# EAGLE schematic DAU_Kupplung_3phasig_V1_11 (EAGLE 6.1)
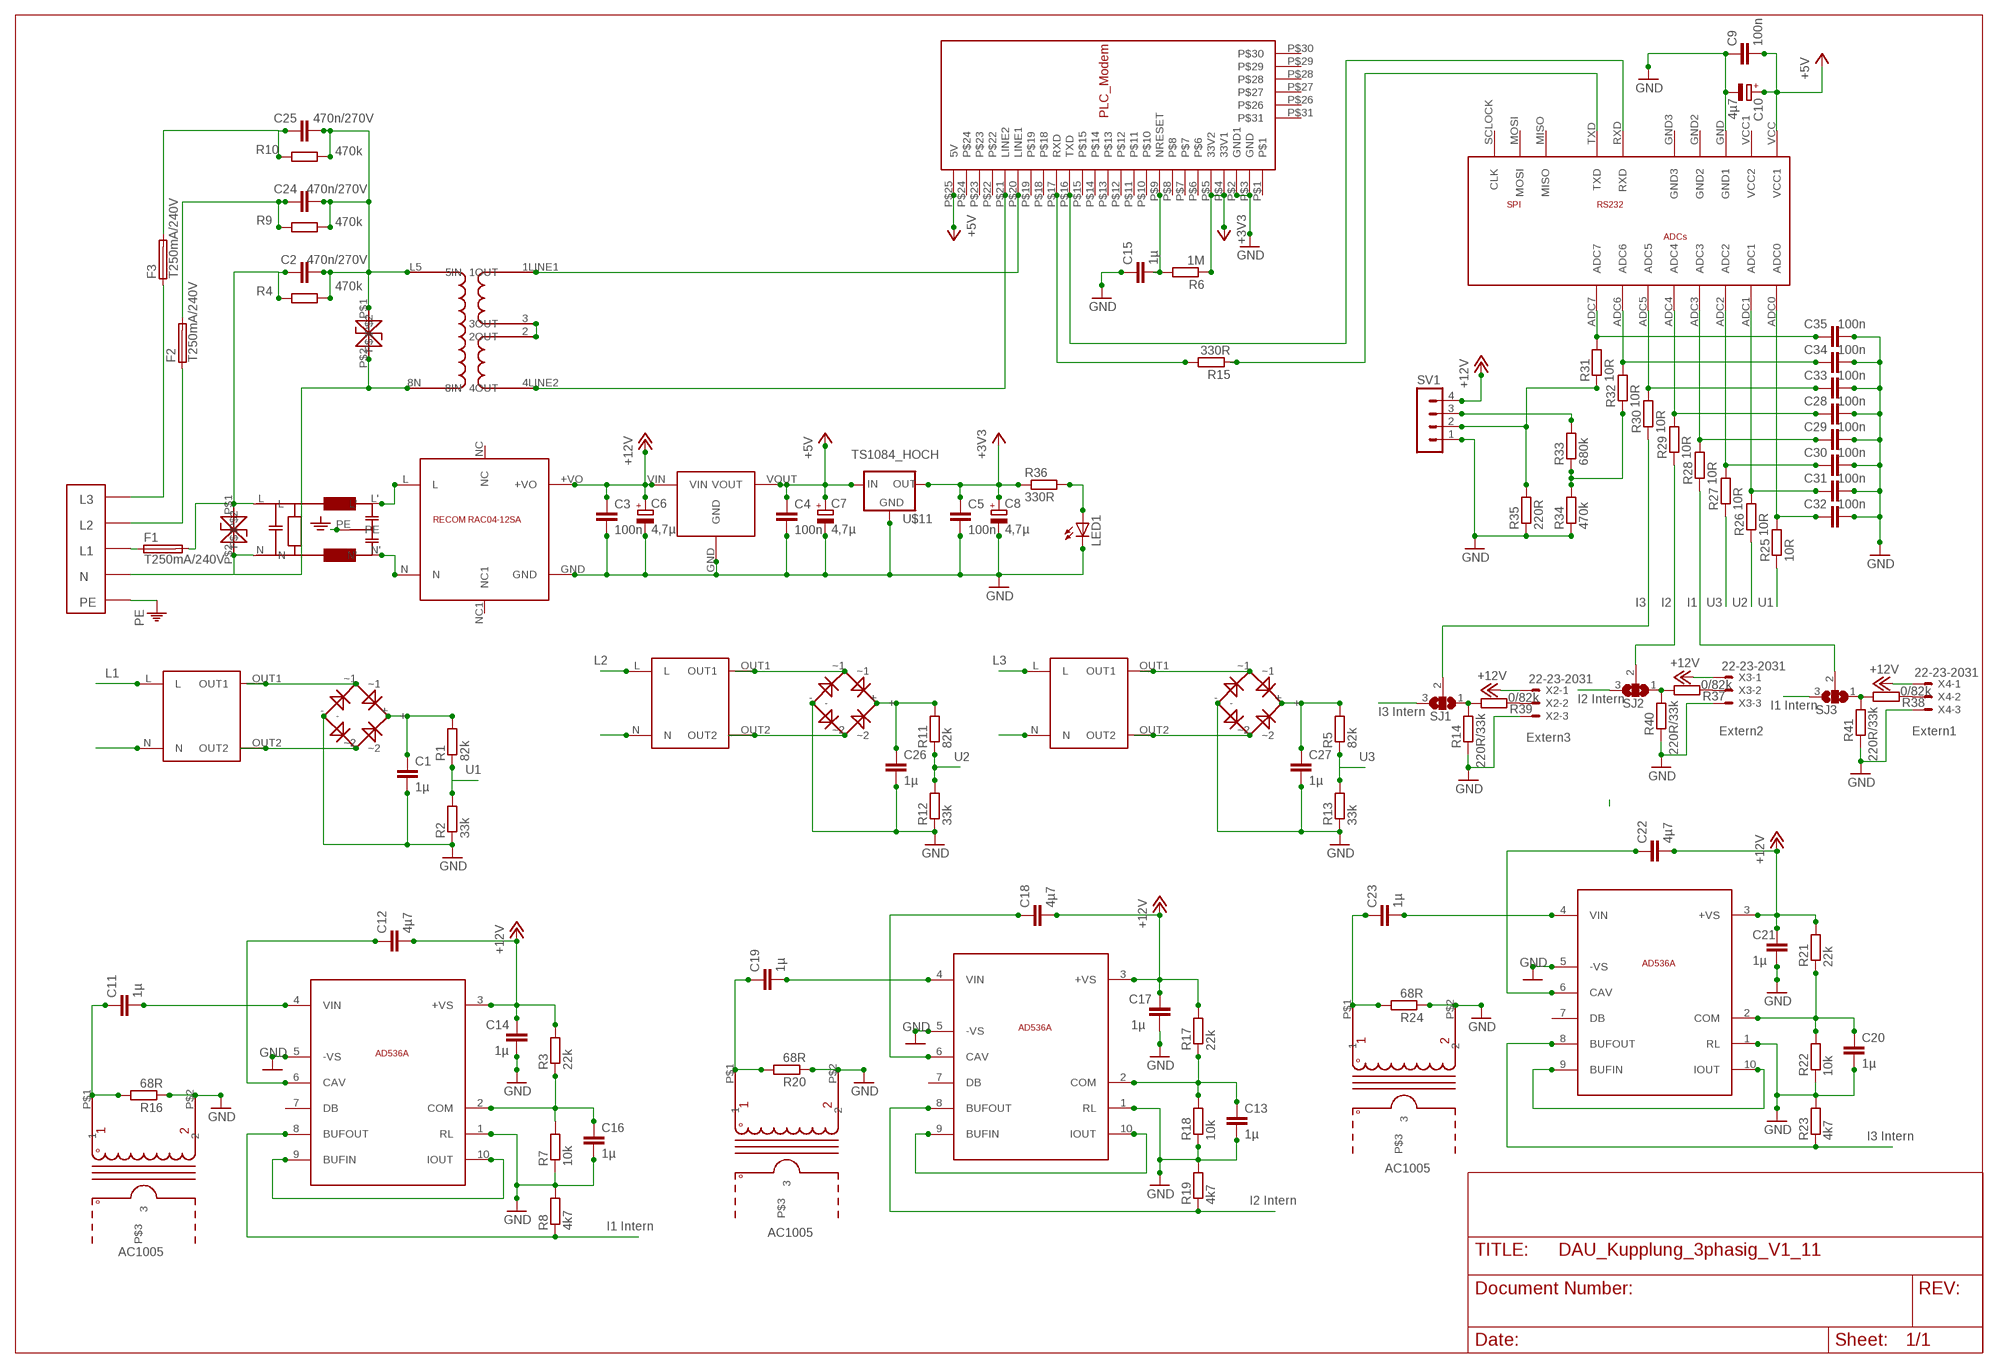
[diagram p0: schematic, sheet 1]

## Parts
AC1002_1  AC1010  [AC1010]
C1  1µ  C-EUC0805K  [C0805K]
C2  470n/270V  C-EU225-087X268  [C225-087X268]
C3  100n  C-EUC0805K  [C0805K]
C4  100n  C-EUC0805K  [C0805K]
C5  100n  C-EUC0805K  [C0805K]
C6  4,7µ  CPOL-EUE2.5-6  [E2,5-6]
C7  4,7µ  CPOL-EUE2.5-6  [E2,5-6]
C8  4,7µ  CPOL-EUE2.5-6  [E2,5-6]
C9  100n  C-EUC0805K  [C0805K]
C10  4µ7  CPOL-EUE2,5-6E  [E2,5-6E]
C11  1µ  C-EUC0805K  [C0805K]
C12  4µ7  C-EUC0805K  [C0805K]
C13  1µ  C-EUC0805K  [C0805K]
C14  1µ  C-EUC0805K  [C0805K]
C15  1µ  C-EUC0805K  [C0805K]
C16  1µ  C-EUC0805K  [C0805K]
C17  1µ  C-EUC0805K  [C0805K]
C18  4µ7  C-EUC0805K  [C0805K]
C19  1µ  C-EUC0805K  [C0805K]
C20  1µ  C-EUC0805K  [C0805K]
C21  1µ  C-EUC0805K  [C0805K]
C22  4µ7  C-EUC0805K  [C0805K]
C23  1µ  C-EUC0805K  [C0805K]
C24  470n/270V  C-EU225-087X268  [C225-087X268]
C25  470n/270V  C-EU225-087X268  [C225-087X268]
C26  1µ  C-EUC0805K  [C0805K]
C27  1µ  C-EUC0805K  [C0805K]
C28  100n  C-EUC0805K  [C0805K]
C29  100n  C-EUC0805K  [C0805K]
C30  100n  C-EUC0805K  [C0805K]
C31  100n  C-EUC0805K  [C0805K]
C32  100n  C-EUC0805K  [C0805K]
C33  100n  C-EUC0805K  [C0805K]
C34  100n  C-EUC0805K  [C0805K]
C35  100n  C-EUC0805K  [C0805K]
F1  T250mA/240V  TR5  [TR5]
F2  T250mA/240V  TR5  [TR5]
F3  T250mA/240V  TR5  [TR5]
LED1  LEDSQR2X5  [LED2X5]
P6KE300CA  P6KE300CA  TSV  [TSV]
R1  82k  R-EU_R0805  [R0805]
R2  33k  R-EU_R0805  [R0805]
R3  22k  R-EU_R0805  [R0805]
R4  470k  R-EU_0204/7  [0204/7]
R5  82k  R-EU_R0805  [R0805]
R6  1M  R-EU_R0805  [R0805]
R7  10k  R-EU_R0805  [R0805]
R8  4k7  R-EU_R0805  [R0805]
R9  470k  R-EU_0204/7  [0204/7]
R10  470k  R-EU_0204/7  [0204/7]
R11  82k  R-EU_R0805  [R0805]
R12  33k  R-EU_R0805  [R0805]
R13  33k  R-EU_R0805  [R0805]
R14  220R/33k  R-EU_R0805  [R0805]
R15  330R  R-EU_R0805  [R0805]
R16  68R  R-EU_0204/7  [0204/7]
R17  22k  R-EU_R0805  [R0805]
R18  10k  R-EU_R0805  [R0805]
R19  4k7  R-EU_R0805  [R0805]
R20  68R  R-EU_0204/7  [0204/7]
R21  22k  R-EU_R0805  [R0805]
R22  10k  R-EU_R0805  [R0805]
R23  4k7  R-EU_R0805  [R0805]
R24  68R  R-EU_0204/7  [0204/7]
R25  10R  R-EU_R0805  [R0805]
R26  10R  R-EU_R0805  [R0805]
R27  10R  R-EU_R0805  [R0805]
R28  10R  R-EU_R0805  [R0805]
R29  10R  R-EU_R0805  [R0805]
R30  10R  R-EU_R0805  [R0805]
R31  10R  R-EU_R0805  [R0805]
R32  10R  R-EU_R0805  [R0805]
R33  680k  R-EU_R0805  [R0805]
R34  470k  R-EU_R0805  [R0805]
R35  220R  R-EU_R0805  [R0805]
R36  330R  R-EU_R0805  [R0805]
R37  0/82k  R-EU_R0805  [R0805]
R38  0/82k  R-EU_R0805  [R0805]
R39  0/82k  R-EU_R0805  [R0805]
R40  220R/33k  R-EU_R0805  [R0805]
R41  220R/33k  R-EU_R0805  [R0805]
SJ1  SJ2WW  [SJ_2W]
SJ2  SJ2WW  [SJ_2W]
SJ3  SJ2WW  [SJ_2W]
SV1  MA04-1  [MA04-1]
TSV2  TSV  [TSV]
U$1  RECOM_RAC04_12SA  [RAC04_12SA]
U$2  SICHERHEITSTRAFO  [TRAFO_0,35VA]
U$3  ADUC831_MINIMUM  [ADUC_MINIMUM]
U$4  MODEMSTECKER  [MODEM_FUSS]
U$5  PLC_UEBERTRAGER_V2  [PLC-UEBERTRAGER_V2]
U$7  AC1010  [AC1010]
U$8  RECTIFIER  [RECTIFIER]
U$10  RECOM_785_05  [RECOM785X]
U$11  TS1084_HOCH  [TS1084_HOCH]
U$12  AD536  [TO100_10PIN]
U$13  AD536  [TO100_10PIN]
U$14  AC1010  [AC1010]
U$15  AD536  [TO100_10PIN]
U$16  SICHERHEITSTRAFO  [TRAFO_0,35VA]
U$17  RECTIFIER  [RECTIFIER]
U$18  SICHERHEITSTRAFO  [TRAFO_0,35VA]
U$19  RECTIFIER  [RECTIFIER]
U$20  NETZFILTER_05_A  [NETZFILTER]
X1  CONNECTO_5_POL  [CONNECTOR_5_POL]
X2  22-23-2031  [22-23-2031]
X3  22-23-2031  [22-23-2031]
X4  22-23-2031  [22-23-2031]

## Nets
+3V3: C5.1 C8.+ R6.1 R36.1 U$4.P$4(33V1) U$4.P$5(33V2) U$11.OUT
+5V: C4.1 C7.+ C9.2 C10.+ U$3.VCC(VCC1) U$4.P$25(5V) U$10.VOUT U$11.IN
+12V: C3.1 C6.+ C12.2 C14.2 C17.2 C18.2 C21.1 C22.2 R3.2 R17.2 R21.2 SV1.4 U$1.+VO U$10.VIN U$12.3(+VS) U$13.3(+VS) U$15.3(+VS) X2.1 X3.1 X4.1
ADC0: C32.1 R25.2 U$3.ADC0
ADC1: C31.1 R26.2 U$3.ADC1
ADC2: C30.1 R27.2 U$3.ADC2
ADC3: C29.1 R28.2 U$3.ADC3
ADC4: C28.1 R29.2 U$3.ADC4
ADC5: C33.1 R30.2 U$3.ADC5
GND: AC1002_1.P$2 C1.2 C3.2 C4.2 C5.2 C6.- C7.- C8.- C9.1 C10.- C13.2 C14.1 C15.1 C16.2 C17.1 C20.2 C21.2 C26.2 C27.2 C28.2 C29.2 C30.2 C31.2 C32.2 C33.2 C34.2 C35.2 LED1.K(C) R2.1 R7.1 R8.2 R12.1 R13.1 R14.1 R16.1 R18.1 R19.2 R20.1 R22.1 R23.2 R24.1 R34.1 R35.1 R40.1 R41.1 SV1.1 U$1.GND U$3.GND(GND1) U$4.P$2(GND1) U$4.P$3(GND) U$7.P$2 U$8.- U$10.GND U$11.GND U$12.1(RL) U$12.5(-VS) U$13.1(RL) U$13.5(-VS) U$14.P$2 U$15.1(RL) U$15.5(-VS) U$17.- U$19.- X2.3 X3.3 X4.3
I1: R28.1 SJ3.2
I1INTERN: R8.1 SJ3.3 U$13.8(BUFOUT)
I2: R29.1 SJ2.2
I2INTERN: R19.1 SJ2.3 U$12.8(BUFOUT)
I3: R30.1 SJ1.2
I3INTERN: R23.1 SJ1.3 U$15.8(BUFOUT)
L1: C2.1 F1.2 P6KE300CA.P$1 R4.2 U$2.L U$20.L
L2: C24.1 F2.2 R9.2 U$16.L
L3: C25.1 F3.2 R10.2 U$18.L
N: P6KE300CA.P$2 TSV2.P$2 U$2.N U$5.8N(8IN) U$16.N U$18.N U$20.N X1.P$4
N$1: R15.2 U$4.P$17(RXD)
N$2: AC1002_1.P$1 C11.1 R16.2
N$3: C11.2 U$13.4(VIN)
N$4: U$2.OUT1 U$8.~1
N$5: U$4.P$20(LINE1) U$5.1LINE1(1OUT)
N$6: U$13.9(BUFIN) U$13.10(IOUT)
N$7: C1.1 R1.2 U$8.+
N$8: C35.1 R31.2 U$3.ADC7
N$9: U$2.OUT2 U$8.~2
N$10: C26.1 R11.2 U$17.+
N$11: U$16.OUT1 U$17.~1
N$12: U$16.OUT2 U$17.~2
N$13: U$4.P$21(LINE2) U$5.4LINE2(4OUT)
N$14: R15.1 U$3.TXD
N$15: U$3.RXD U$4.P$16(TXD)
N$16: U$1.L U$20.L'
N$17: C16.1 R3.1 R7.2 U$13.2(COM)
N$19: LED1.A R36.2
N$20: C15.2 R6.2 U$4.P$9(NRESET)
N$21: C12.1 U$13.6(CAV)
N$22: C19.1 R20.2 U$7.P$1
N$23: C19.2 U$12.4(VIN)
N$24: U$12.9(BUFIN) U$12.10(IOUT)
N$25: C34.1 R32.2 U$3.ADC6
N$26: C2.2 C24.2 C25.2 R4.1 R9.1 R10.1 TSV2.P$1 U$5.L5(5IN)
N$27: C13.1 R17.1 R18.2 U$12.2(COM)
N$29: C18.1 U$12.6(CAV)
N$30: C23.1 R24.2 U$14.P$1
N$31: C23.2 U$15.4(VIN)
N$32: U$15.9(BUFIN) U$15.10(IOUT)
N$33: U$5.2(2OUT) U$5.3(3OUT)
N$34: C27.1 R5.2 U$19.+
N$35: U$18.OUT1 U$19.~1
N$36: U$18.OUT2 U$19.~2
N$37: R33.2 SV1.3
N$38: C20.1 R21.1 R22.2 U$15.2(COM)
N$40: C22.1 U$15.6(CAV)
N$41: U$1.N U$20.N'
N$42: R37.2 R40.2 SJ2.1
N$43: R37.1 X3.2
N$45: R14.2 R39.2 SJ1.1
N$46: F1.1 X1.P$3
N$47: F2.1 X1.P$2
N$48: F3.1 X1.P$1
N$49: R32.1 R33.1 R34.2
N$50: R31.1 R35.2 SV1.2
N$53: R39.1 X2.2
N$54: R38.2 R41.2 SJ3.1
N$55: R38.1 X4.2
PE: U$20.PE X1.P$5
U1: R1.1 R2.2 R25.1
U2: R11.1 R12.2 R26.1
U3: R5.1 R13.2 R27.1
Unconnected: AC1002_1.P$3 U$1.NC U$1.NC1 U$3.GND2 U$3.GND3 U$3.MISO U$3.MOSI U$3.SCLOCK(CLK) U$3.VCC1(VCC2) U$4.P$1 U$4.P$6 U$4.P$7 U$4.P$8 U$4.P$10 U$4.P$11 U$4.P$12 U$4.P$13 U$4.P$14 U$4.P$15 U$4.P$18 U$4.P$19 U$4.P$22 U$4.P$23 U$4.P$24 U$4.P$26 U$4.P$27 U$4.P$28 U$4.P$29 U$4.P$30 U$4.P$31 U$7.P$3 U$12.7(DB) U$13.7(DB) U$14.P$3 U$15.7(DB)

## Notes on the sheet
- L3
- L2
- L1
- N
- PE | I3 | I2 | I1 | U3 | U2 | U1
- L2 | L3
- L1
- I2 Intern
- I1 Intern
- I3 Intern
- Extern2 | Extern1
- Extern3
- U2 | U3
- U1
- I3 Intern
- AC1005
- I2 Intern
- I1 Intern
- AC1005
- AC1005

## Library data of the parts
AC1002_1 U$7 U$14 = ADS:AC1010
C1-C5 C9 C11-C35 = resistor:C-EU: CAPACITOR, European symbol
C6-C8 = resistor:CPOL-EU: POLARIZED CAPACITOR, European symbol
C10 = rcl:CPOL-EU: POLARIZED CAPACITOR, European symbol
F1-F3 = fuse:TR5: FUSE Wickmann; OC_FARNELL: unknown; OC_NEWARK: unknown
LED1 = led:LED: LED OSRAM: - CHIPLED LG R971, LG N971, LY N971, LG Q971, LY Q971, LO R971, LY R971 LH N974, LH R974 LS Q976, LO Q976, LY Q976 LO Q996 - Hyper CHIPLED LW Q18S LB Q993, LB Q99A, LB R99A - SideLED LS A670, LO A670, LY A670, LG A670, LP A670 LB A673, LV A673, LT A673, LW A673 LH A674 LY A675 LS A676, LA A676, LO A676, LY A676, LW A676 LS A679, LY A679, LG A679 - Hyper Micro SIDELED® LS Y876, LA Y876, LO Y876, LY Y876 LT Y87S - SmartLED LW L88C, LW L88S LB L89C, LB L89S, LG L890 LS L89K, LO L89K, LY L89K LS L896, LA L896, LO L896, LY L896 - TOPLED LS T670, LO T670, LY T670, LG T670, LP T670 LSG T670, LSP T670, LSY T670, LOP T670, LYG T670 LG T671, LOG T671, LSG T671 LB T673, LV T673, LT T673, LW T673 LH T674 LS T676, LA T676, LO T676, LY T676, LB T676, LH T676, LSB T676, LW T676 LB T67C, LV T67C, LT T67C, LS T67K, LO T67K, LY T67K, LW E67C LS E67B, LA E67B, LO E67B, LY E67B, LB E67C, LV E67C, LT E67C LW T67C LS T679, LY T679, LG T679 LS T770, LO T770, LY T770, LG T770, LP T770 LB T773, LV T773, LT T773, LW T773 LH T774 LS E675, LA E675, LY E675, LS T675 LS T776, LA T776, LO T776, LY T776, LB T776 LHGB T686 LT T68C, LB T68C - Hyper Mini TOPLED® LB M676 - Mini TOPLED Santana® LG M470 LS M47K, LO M47K, LY M47K Source: http://www.osram.convergy.de LUXEON: - LUMILED® LXK2-PW12-R00, LXK2-PW12-S00, LXK2-PW14-U00, LXK2-PW14-V00 LXK2-PM12-R00, LXK2-PM12-S00, LXK2-PM14-U00 LXK2-PE12-Q00, LXK2-PE12-R00, LXK2-PE12-S00, LXK2-PE14-T00, LXK2-PE14-U00 LXK2-PB12-K00, LXK2-PB12-L00, LXK2-PB12-M00, LXK2-PB14-N00, LXK2-PB14-P00, LXK2-PB14-Q00 LXK2-PR12-L00, LXK2-PR12-M00, LXK2-PR14-Q00, LXK2-PR14-R00 LXK2-PD12-Q00, LXK2-PD12-R00, LXK2-PD12-S00 LXK2-PH12-R00, LXK2-PH12-S00 LXK2-PL12-P00, LXK2-PL12-Q00, LXK2-PL12-R00 Source: www.luxeon.com KINGBRIGHT: KA-3528ASYC Source: www.kingbright.com
P6KE300CA TSV2 = ADS:TSV
R1-R41 = resistor:R-EU_: RESISTOR, European symbol
SJ1-SJ3 = jumper:SJ2W: SMD solder JUMPER
SV1 = con-lstb:MA04-1: PIN HEADER; OC_FARNELL: unknown; OC_NEWARK: unknown
U$1 = ADS:RECOM_RAC04_12SA
U$2 U$16 U$18 = ADS:SICHERHEITSTRAFO
U$3 = ADS_ADUCBoards:ADUC831_MINIMUM
U$4 = ADS:MODEMSTECKER
U$5 = ADS1:PLC_UEBERTRAGER_V2
U$8 U$17 U$19 = ADS:RECTIFIER
U$10 = ADS:RECOM_785_05
U$11 = ADS:TS1084_HOCH
U$12 U$13 U$15 = ADS:AD536
U$20 = ADS:NETZFILTER_05_A
X1 = ADS:CONNECTO_5_POL
X2-X4 = con-molex:22-23-2031: .100" (2.54mm) Center Header - 3 Pin; MF: MOLEX; MPN: 22-23-2031; OC_FARNELL: 1462950; OC_NEWARK: 30C0862